# Altium schematic sheet Mosfet_Board.SchDoc
size A4; SheetNumber: 5; SheetTotal: 8
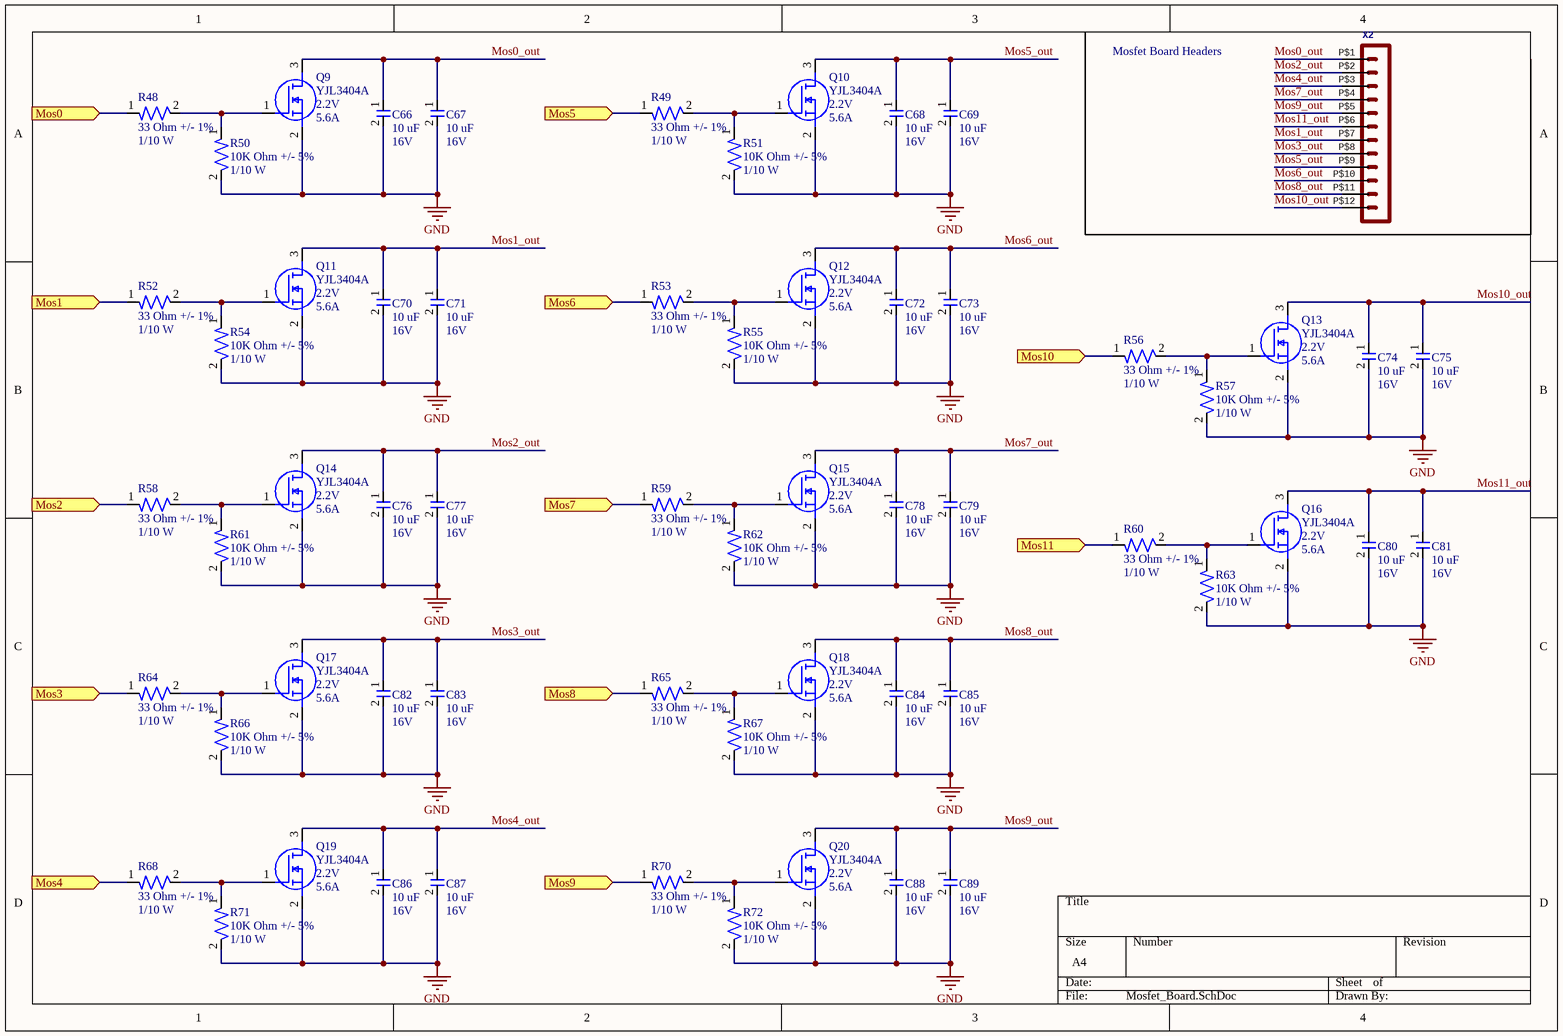
[diagram p0: Mosfet_Board.SchDoc]

## Parts
C66  Capacitance: 10 uF  Voltage Rating: 16V  [CAP-0805]  (hidden comment: MCS1802GS-20-Z)
C67  Capacitance: 10 uF  Voltage Rating: 16V  [CAP-0805]  (hidden comment: MCS1802GS-20-Z)
C68  Capacitance: 10 uF  Voltage Rating: 16V  [CAP-0805]  (hidden comment: MCS1802GS-20-Z)
C69  Capacitance: 10 uF  Voltage Rating: 16V  [CAP-0805]  (hidden comment: MCS1802GS-20-Z)
C70  Capacitance: 10 uF  Voltage Rating: 16V  [CAP-0805]  (hidden comment: MCS1802GS-20-Z)
C71  Capacitance: 10 uF  Voltage Rating: 16V  [CAP-0805]  (hidden comment: MCS1802GS-20-Z)
C72  Capacitance: 10 uF  Voltage Rating: 16V  [CAP-0805]  (hidden comment: MCS1802GS-20-Z)
C73  Capacitance: 10 uF  Voltage Rating: 16V  [CAP-0805]  (hidden comment: MCS1802GS-20-Z)
C74  Capacitance: 10 uF  Voltage Rating: 16V  [CAP-0805]  (hidden comment: MCS1802GS-20-Z)
C75  Capacitance: 10 uF  Voltage Rating: 16V  [CAP-0805]  (hidden comment: MCS1802GS-20-Z)
C76  Capacitance: 10 uF  Voltage Rating: 16V  [CAP-0805]  (hidden comment: MCS1802GS-20-Z)
C77  Capacitance: 10 uF  Voltage Rating: 16V  [CAP-0805]  (hidden comment: MCS1802GS-20-Z)
C78  Capacitance: 10 uF  Voltage Rating: 16V  [CAP-0805]  (hidden comment: MCS1802GS-20-Z)
C79  Capacitance: 10 uF  Voltage Rating: 16V  [CAP-0805]  (hidden comment: MCS1802GS-20-Z)
C80  Capacitance: 10 uF  Voltage Rating: 16V  [CAP-0805]  (hidden comment: MCS1802GS-20-Z)
C81  Capacitance: 10 uF  Voltage Rating: 16V  [CAP-0805]  (hidden comment: MCS1802GS-20-Z)
C82  Capacitance: 10 uF  Voltage Rating: 16V  [CAP-0805]  (hidden comment: MCS1802GS-20-Z)
C83  Capacitance: 10 uF  Voltage Rating: 16V  [CAP-0805]  (hidden comment: MCS1802GS-20-Z)
C84  Capacitance: 10 uF  Voltage Rating: 16V  [CAP-0805]  (hidden comment: MCS1802GS-20-Z)
C85  Capacitance: 10 uF  Voltage Rating: 16V  [CAP-0805]  (hidden comment: MCS1802GS-20-Z)
C86  Capacitance: 10 uF  Voltage Rating: 16V  [CAP-0805]  (hidden comment: MCS1802GS-20-Z)
C87  Capacitance: 10 uF  Voltage Rating: 16V  [CAP-0805]  (hidden comment: MCS1802GS-20-Z)
C88  Capacitance: 10 uF  Voltage Rating: 16V  [CAP-0805]  (hidden comment: MCS1802GS-20-Z)
C89  Capacitance: 10 uF  Voltage Rating: 16V  [CAP-0805]  (hidden comment: MCS1802GS-20-Z)
Q9  YJL3404A  Vgs(th): 2.2V  Drain Current: 5.6A  [NMOS-SOT23-3]
Q10  YJL3404A  Vgs(th): 2.2V  Drain Current: 5.6A  [NMOS-SOT23-3]
Q11  YJL3404A  Vgs(th): 2.2V  Drain Current: 5.6A  [NMOS-SOT23-3]
Q12  YJL3404A  Vgs(th): 2.2V  Drain Current: 5.6A  [NMOS-SOT23-3]
Q13  YJL3404A  Vgs(th): 2.2V  Drain Current: 5.6A  [NMOS-SOT23-3]
Q14  YJL3404A  Vgs(th): 2.2V  Drain Current: 5.6A  [NMOS-SOT23-3]
Q15  YJL3404A  Vgs(th): 2.2V  Drain Current: 5.6A  [NMOS-SOT23-3]
Q16  YJL3404A  Vgs(th): 2.2V  Drain Current: 5.6A  [NMOS-SOT23-3]
Q17  YJL3404A  Vgs(th): 2.2V  Drain Current: 5.6A  [NMOS-SOT23-3]
Q18  YJL3404A  Vgs(th): 2.2V  Drain Current: 5.6A  [NMOS-SOT23-3]
Q19  YJL3404A  Vgs(th): 2.2V  Drain Current: 5.6A  [NMOS-SOT23-3]
Q20  YJL3404A  Vgs(th): 2.2V  Drain Current: 5.6A  [NMOS-SOT23-3]
R48  Resistance: 33 Ohm +/- 1%  Power: 1/10 W  [RES-0402]  (hidden comment: ERJ2RKF33R0X)
R49  Resistance: 33 Ohm +/- 1%  Power: 1/10 W  [RES-0402]  (hidden comment: ERJ2RKF33R0X)
R50  Resistance: 10K Ohm +/- 5%  Power: 1/10 W  [RES-0402]  (hidden comment: ERJ2GEJ103X)
R51  Resistance: 10K Ohm +/- 5%  Power: 1/10 W  [RES-0402]  (hidden comment: ERJ2GEJ103X)
R52  Resistance: 33 Ohm +/- 1%  Power: 1/10 W  [RES-0402]  (hidden comment: ERJ2RKF33R0X)
R53  Resistance: 33 Ohm +/- 1%  Power: 1/10 W  [RES-0402]  (hidden comment: ERJ2RKF33R0X)
R54  Resistance: 10K Ohm +/- 5%  Power: 1/10 W  [RES-0402]  (hidden comment: ERJ2GEJ103X)
R55  Resistance: 10K Ohm +/- 5%  Power: 1/10 W  [RES-0402]  (hidden comment: ERJ2GEJ103X)
R56  Resistance: 33 Ohm +/- 1%  Power: 1/10 W  [RES-0402]  (hidden comment: ERJ2RKF33R0X)
R57  Resistance: 10K Ohm +/- 5%  Power: 1/10 W  [RES-0402]  (hidden comment: ERJ2GEJ103X)
R58  Resistance: 33 Ohm +/- 1%  Power: 1/10 W  [RES-0402]  (hidden comment: ERJ2RKF33R0X)
R59  Resistance: 33 Ohm +/- 1%  Power: 1/10 W  [RES-0402]  (hidden comment: ERJ2RKF33R0X)
R60  Resistance: 33 Ohm +/- 1%  Power: 1/10 W  [RES-0402]  (hidden comment: ERJ2RKF33R0X)
R61  Resistance: 10K Ohm +/- 5%  Power: 1/10 W  [RES-0402]  (hidden comment: ERJ2GEJ103X)
R62  Resistance: 10K Ohm +/- 5%  Power: 1/10 W  [RES-0402]  (hidden comment: ERJ2GEJ103X)
R63  Resistance: 10K Ohm +/- 5%  Power: 1/10 W  [RES-0402]  (hidden comment: ERJ2GEJ103X)
R64  Resistance: 33 Ohm +/- 1%  Power: 1/10 W  [RES-0402]  (hidden comment: ERJ2RKF33R0X)
R65  Resistance: 33 Ohm +/- 1%  Power: 1/10 W  [RES-0402]  (hidden comment: ERJ2RKF33R0X)
R66  Resistance: 10K Ohm +/- 5%  Power: 1/10 W  [RES-0402]  (hidden comment: ERJ2GEJ103X)
R67  Resistance: 10K Ohm +/- 5%  Power: 1/10 W  [RES-0402]  (hidden comment: ERJ2GEJ103X)
R68  Resistance: 33 Ohm +/- 1%  Power: 1/10 W  [RES-0402]  (hidden comment: ERJ2RKF33R0X)
R70  Resistance: 33 Ohm +/- 1%  Power: 1/10 W  [RES-0402]  (hidden comment: ERJ2RKF33R0X)
R71  Resistance: 10K Ohm +/- 5%  Power: 1/10 W  [RES-0402]  (hidden comment: ERJ2GEJ103X)
R72  Resistance: 10K Ohm +/- 5%  Power: 1/10 W  [RES-0402]  (hidden comment: ERJ2GEJ103X)
X2  Molex - Micro-Fit 3.0 Series connector,  3.00mm (0.118") pitch header, 12 positions.  [44764-1201]  (value not drawn)

## Ports
Mos0 (in), Mos1 (in), Mos2 (in), Mos3 (in), Mos4 (in), Mos5 (in), Mos6 (in), Mos7 (in), Mos8 (in), Mos9 (in), Mos10 (in), Mos11 (in)

## Nets
GND: C66.2 C67.2 C68.2 C69.2 C70.2 C71.2 C72.2 C73.2 C74.2 C75.2 C76.2 C77.2 C78.2 C79.2 C80.2 C81.2 C82.2 C83.2 C84.2 C85.2 C86.2 C87.2 C88.2 C89.2 Q9.2(S) Q10.2(S) Q11.2(S) Q12.2(S) Q13.2(S) Q14.2(S) Q15.2(S) Q16.2(S) Q17.2(S) Q18.2(S) Q19.2(S) Q20.2(S) R50.2 R51.2 R54.2 R55.2 R57.2 R61.2 R62.2 R63.2 R66.2 R67.2 R71.2 R72.2
Mos0: R48.1 ; port Mos0
Mos0_out: C66.1 C67.1 Q9.3(D) X2.P$1
Mos1: R52.1 ; port Mos1
Mos1_out: C70.1 C71.1 Q11.3(D) X2.P$7
Mos2: R58.1 ; port Mos2
Mos2_out: C76.1 C77.1 Q14.3(D) X2.P$2
Mos3: R64.1 ; port Mos3
Mos3_out: C82.1 C83.1 Q17.3(D) X2.P$8
Mos4: R68.1 ; port Mos4
Mos4_out: C86.1 C87.1 Q19.3(D) X2.P$3
Mos5: R49.1 ; port Mos5
Mos5_out: C68.1 C69.1 Q10.3(D) X2.P$9
Mos6: R53.1 ; port Mos6
Mos6_out: C72.1 C73.1 Q12.3(D) X2.P$10
Mos7: R59.1 ; port Mos7
Mos7_out: C78.1 C79.1 Q15.3(D) X2.P$4
Mos8: R65.1 ; port Mos8
Mos8_out: C84.1 C85.1 Q18.3(D) X2.P$11
Mos9: R70.1 ; port Mos9
Mos9_out: C88.1 C89.1 Q20.3(D) X2.P$5
Mos10: R56.1 ; port Mos10
Mos10_out: C74.1 C75.1 Q13.3(D) X2.P$12
Mos11: R60.1 ; port Mos11
Mos11_out: C80.1 C81.1 Q16.3(D) X2.P$6
NetQ9_1: Q9.1(G) R48.2 R50.1
NetQ10_1: Q10.1(G) R49.2 R51.1
NetQ11_1: Q11.1(G) R52.2 R54.1
NetQ12_1: Q12.1(G) R53.2 R55.1
NetQ13_1: Q13.1(G) R56.2 R57.1
NetQ14_1: Q14.1(G) R58.2 R61.1
NetQ15_1: Q15.1(G) R59.2 R62.1
NetQ16_1: Q16.1(G) R60.2 R63.1
NetQ17_1: Q17.1(G) R64.2 R66.1
NetQ18_1: Q18.1(G) R65.2 R67.1
NetQ19_1: Q19.1(G) R68.2 R71.1
NetQ20_1: Q20.1(G) R70.2 R72.1

## Notes on the sheet
- Mosfet Board Headers

## Library data of the parts
C66-C89 = CAP-10U-0002: 10 µF ±10% 16V Ceramic Capacitor X7R 0805 (2012 Metric); Package Size: 0805
Q9-Q20 = NMOS-5.6A-0001: N-Channel 30 V 5.6A (Ta) 1.2W (Ta) Surface Mount SOT-23; Vdss: 30V; Rds On: 24 mOhm; Manufacturer Part Number: YJL3404A; Package Size: SOT23
R48 R49 R52 R53 R56 R58-R60 R64 R65 R68 R70 = RES-33-0003-JLC: 100mW Thick Film Resistors ±100ppm/℃ ±1% -55℃~+155℃ 33Ω 0402  Chip Resistor - Surface Mount ROHS; assembled?: yes; JLC part number: C278594
R50 R51 R54 R55 R57 R61-R63 R66 R67 R71 R72 = RES-10K-0003-JLC: 100mW Thick Film Resistors 100V ±5% ±200ppm/℃ -55℃~+155℃ 10kΩ 0402  Chip Resistor - Surface Mount ROHS; assembled?: yes; JLC part number: C278577
X2 = HEADER_POS12_?44764-1201: GateName_1: G$1; SymbolName_1: HEADER_POS12; DeviceName: 44764-1201; LibraryName: con-molex-micro-fit-3_0_2; DeviceSetName: HEADER_POS12_?; Package: 44764-1201